# EAGLE design open-race-scale-pi-zero-board-v.02 (EAGLE 8.2.2)
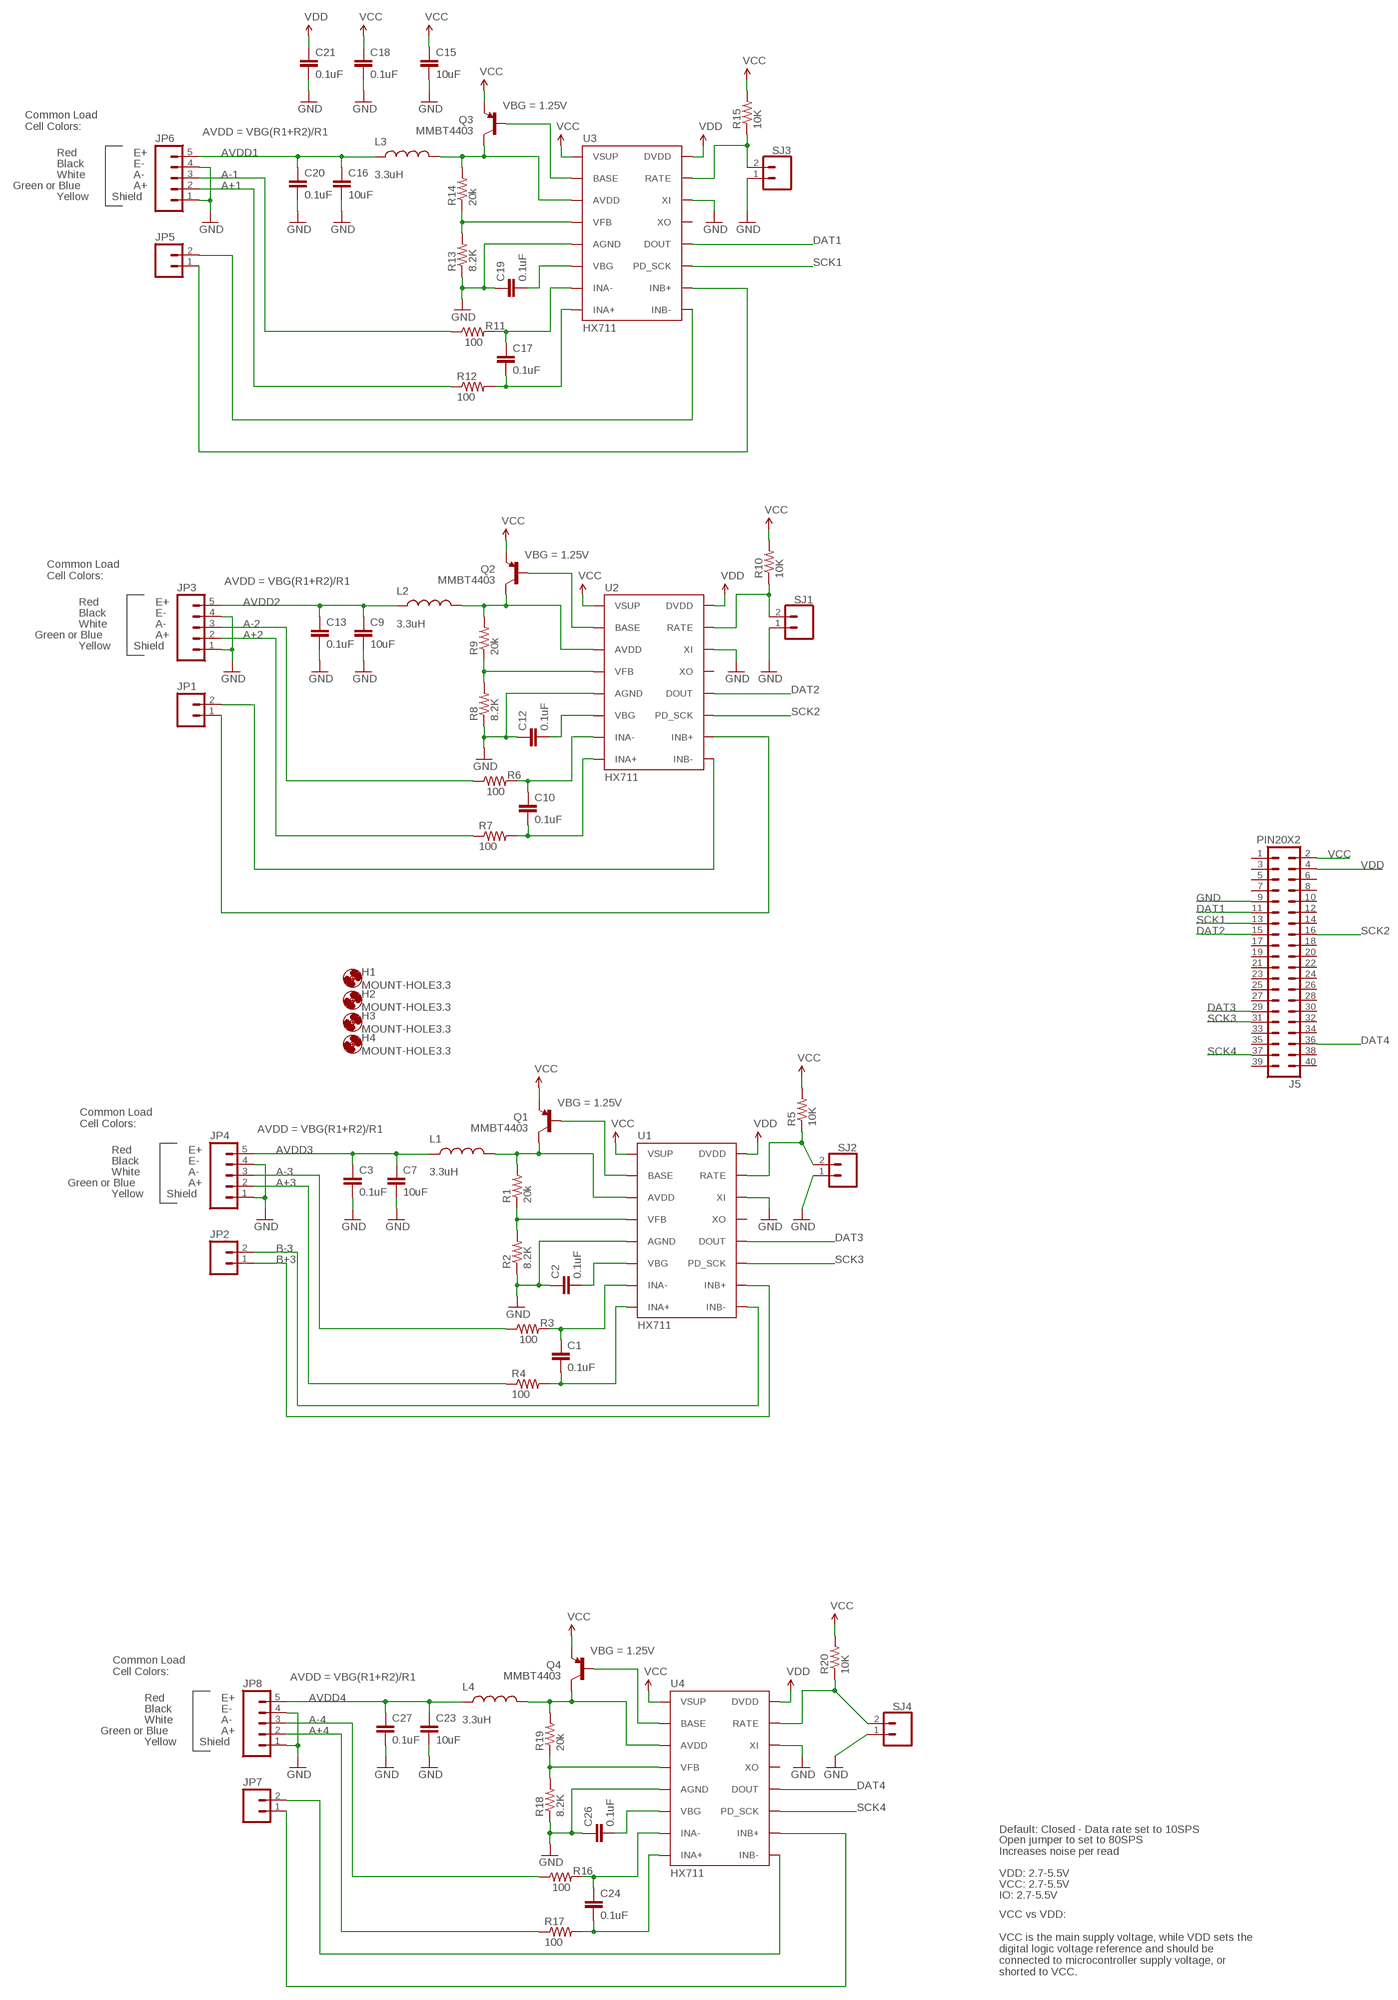
[diagram p0: schematic, sheet 1]

## Parts
C1  0.1uF  0.1UF-25V-5%(0603)  [0603-CAP]
C2  0.1uF  0.1UF-25V-5%(0603)  [0603-CAP]
C3  0.1uF  0.1UF-25V-5%(0603)  [0603-CAP]
C7  10uF  10UF50V20%(1210)  [1210]
C9  10uF  10UF50V20%(1210)  [1210]
C10  0.1uF  0.1UF-25V-5%(0603)  [0603-CAP]
C12  0.1uF  0.1UF-25V-5%(0603)  [0603-CAP]
C13  0.1uF  0.1UF-25V-5%(0603)  [0603-CAP]
C15  10uF  10UF50V20%(1210)  [1210]
C16  10uF  10UF50V20%(1210)  [1210]
C17  0.1uF  0.1UF-25V-5%(0603)  [0603-CAP]
C18  0.1uF  0.1UF-25V-5%(0603)  [0603-CAP]
C19  0.1uF  0.1UF-25V-5%(0603)  [0603-CAP]
C20  0.1uF  0.1UF-25V-5%(0603)  [0603-CAP]
C21  0.1uF  0.1UF-25V-5%(0603)  [0603-CAP]
C23  10uF  10UF50V20%(1210)  [1210]
C24  0.1uF  0.1UF-25V-5%(0603)  [0603-CAP]
C26  0.1uF  0.1UF-25V-5%(0603)  [0603-CAP]
C27  0.1uF  0.1UF-25V-5%(0603)  [0603-CAP]
H1  MOUNT-HOLE3.3  [3,3]
H2  MOUNT-HOLE3.3  [3,3]
H3  MOUNT-HOLE3.3  [3,3]
H4  MOUNT-HOLE3.3  [3,3]
J5  PIN20X2  [PIN_20X2]
JP1  M02PTH  [1X02@1]
JP2  M02PTH  [1X02@1]
JP3  M05PTH  [1X05]
JP4  M05PTH  [1X05]
JP5  M02PTH  [1X02@1]
JP6  M05PTH  [1X05]
JP7  M02PTH  [1X02@1]
JP8  M05PTH  [1X05]
L1  3.3uH  INDUCTOR0805-IND  [0805]
L2  3.3uH  INDUCTOR0805-IND  [0805]
L3  3.3uH  INDUCTOR0805-IND  [0805]
L4  3.3uH  INDUCTOR0805-IND  [0805]
Q1  MMBT4403  TRANSISTOR_PNPMMBT4403  [SOT23-3]
Q2  MMBT4403  TRANSISTOR_PNPMMBT4403  [SOT23-3]
Q3  MMBT4403  TRANSISTOR_PNPMMBT4403  [SOT23-3]
Q4  MMBT4403  TRANSISTOR_PNPMMBT4403  [SOT23-3]
R1  20k  20KOHM1/10W1%(0603)  [0603-RES]
R2  8.2K  8.2KOHM-1/10W-5%(0603)  [0603-RES]
R3  100  100OHM-1/10W-1%(0603)  [0603-RES]
R4  100  100OHM-1/10W-1%(0603)  [0603-RES]
R5  10K  10KOHM-1/10W-1%(0603)0603  [0603-RES]
R6  100  100OHM-1/10W-1%(0603)  [0603-RES]
R7  100  100OHM-1/10W-1%(0603)  [0603-RES]
R8  8.2K  8.2KOHM-1/10W-5%(0603)  [0603-RES]
R9  20k  20KOHM1/10W1%(0603)  [0603-RES]
R10  10K  10KOHM-1/10W-1%(0603)0603  [0603-RES]
R11  100  100OHM-1/10W-1%(0603)  [0603-RES]
R12  100  100OHM-1/10W-1%(0603)  [0603-RES]
R13  8.2K  8.2KOHM-1/10W-5%(0603)  [0603-RES]
R14  20k  20KOHM1/10W1%(0603)  [0603-RES]
R15  10K  10KOHM-1/10W-1%(0603)0603  [0603-RES]
R16  100  100OHM-1/10W-1%(0603)  [0603-RES]
R17  100  100OHM-1/10W-1%(0603)  [0603-RES]
R18  8.2K  8.2KOHM-1/10W-5%(0603)  [0603-RES]
R19  20k  20KOHM1/10W1%(0603)  [0603-RES]
R20  10K  10KOHM-1/10W-1%(0603)0603  [0603-RES]
SJ1  CONN_02  [1X02]
SJ2  CONN_02  [1X02]
SJ3  CONN_02  [1X02]
SJ4  CONN_02  [1X02]
U1  HX711  HX711HX711  [SO16]
U2  HX711  HX711HX711  [SO16]
U3  HX711  HX711HX711  [SO16]
U4  HX711  HX711HX711  [SO16]

## Nets
A+1: JP6.2 R12.1
A+2: JP3.2 R7.1
A+3: JP4.2 R4.1
A+4: JP8.2 R17.1
A-1: JP6.3 R11.1
A-2: JP3.3 R6.1
A-3: JP4.3 R3.1
A-4: JP8.3 R16.1
AVDD1: C16.1 C20.1 JP6.5 L3.1
AVDD2: C9.1 C13.1 JP3.5 L2.1
AVDD3: C3.1 C7.1 JP4.5 L1.1
AVDD4: C23.1 C27.1 JP8.5 L4.1
B+3: JP2.1 U1.10(INB+)
B-3: JP2.2 U1.9(INB-)
DAT1: J5.11 U3.12(DOUT)
DAT2: J5.15 U2.12(DOUT)
DAT3: J5.29 U1.12(DOUT)
DAT4: J5.36 U4.12(DOUT)
GND: C2.1 C3.2 C7.2 C9.2 C12.1 C13.2 C15.2 C16.2 C18.2 C19.1 C20.2 C21.2 C23.2 C26.1 C27.2 J5.9 JP3.1 JP3.4 JP4.1 JP4.4 JP6.1 JP6.4 JP8.1 JP8.4 R2.1 R8.1 R13.1 R18.1 SJ1.1 SJ2.1 SJ3.1 SJ4.1 U1.5(AGND) U1.14(XI) U2.5(AGND) U2.14(XI) U3.5(AGND) U3.14(XI) U4.5(AGND) U4.14(XI)
N$1: R5.1 SJ2.2 U1.15(RATE)
N$2: C1.1 R3.2 U1.7(INA-)
N$3: C1.2 R4.2 U1.8(INA+)
N$4: Q1.1(B) U1.2(BASE)
N$5: L1.2 Q1.3(C) R1.2 U1.3(AVDD)
N$6: R1.1 R2.2 U1.4(VFB)
N$7: C2.2 U1.6(VBG)
N$8: JP7.1 U4.10(INB+)
N$9: R8.2 R9.1 U2.4(VFB)
N$10: C12.2 U2.6(VBG)
N$11: JP5.1 U3.10(INB+)
N$12: JP5.2 U3.9(INB-)
N$13: JP7.2 U4.9(INB-)
N$14: JP1.1 U2.10(INB+)
N$15: JP1.2 U2.9(INB-)
N$20: C17.1 R11.2 U3.7(INA-)
N$21: C17.2 R12.2 U3.8(INA+)
N$22: Q4.1(B) U4.2(BASE)
N$23: R18.2 R19.1 U4.4(VFB)
N$24: C26.2 U4.6(VBG)
N$25: L4.2 Q4.3(C) R19.2 U4.3(AVDD)
N$26: R20.1 SJ4.2 U4.15(RATE)
N$27: C24.1 R16.2 U4.7(INA-)
N$28: C24.2 R17.2 U4.8(INA+)
N$82: Q2.1(B) U2.2(BASE)
N$112: L2.2 Q2.3(C) R9.2 U2.3(AVDD)
N$122: R10.1 SJ1.2 U2.15(RATE)
N$132: C10.1 R6.2 U2.7(INA-)
N$142: C10.2 R7.2 U2.8(INA+)
N$151: Q3.1(B) U3.2(BASE)
N$161: R13.2 R14.1 U3.4(VFB)
N$171: C19.2 U3.6(VBG)
N$182: L3.2 Q3.3(C) R14.2 U3.3(AVDD)
N$191: R15.1 SJ3.2 U3.15(RATE)
SCK1: J5.13 U3.11(PD_SCK)
SCK2: J5.16 U2.11(PD_SCK)
SCK3: J5.31 U1.11(PD_SCK)
SCK4: J5.37 U4.11(PD_SCK)
VCC: C15.1 C18.1 J5.2 Q1.2(E) Q2.2(E) Q3.2(E) Q4.2(E) R5.2 R10.2 R15.2 R20.2 U1.1(VSUP) U2.1(VSUP) U3.1(VSUP) U4.1(VSUP)
VDD: C21.1 J5.4 U1.16(DVDD) U2.16(DVDD) U3.16(DVDD) U4.16(DVDD)
Unconnected: J5.1 J5.3 J5.5 J5.6 J5.7 J5.8 J5.10 J5.12 J5.14 J5.17 J5.18 J5.19 J5.20 J5.21 J5.22 J5.23 J5.24 J5.25 J5.26 J5.27 J5.28 J5.30 J5.32 J5.33 J5.34 J5.35 J5.38 J5.39 J5.40 U1.13(XO) U2.13(XO) U3.13(XO) U4.13(XO)

## Notes on the sheet
- VBG = 1.25V
- Common Load
  Cell Colors:
- AVDD = VBG(R1+R2)/R1
- Red | E+
- Black | E-
- White | A-
- Green or Blue | A+
- Yellow | Shield
- VBG = 1.25V
- Common Load
  Cell Colors:
- AVDD = VBG(R1+R2)/R1
- Red | E+
- Black | E-
- White | A-
- Green or Blue | A+
- Yellow | Shield
- VBG = 1.25V
- Common Load
  Cell Colors:
- AVDD = VBG(R1+R2)/R1
- Red | E+
- Black | E-
- White | A-
- Green or Blue | A+
- Yellow | Shield
- VBG = 1.25V
- Common Load
  Cell Colors:
- AVDD = VBG(R1+R2)/R1
- Red | E+
- Black | E-
- White | A-
- Green or Blue | A+
- Yellow | Shield
- Default: Closed - Data rate set to 10SPS
- Open jumper to set to 80SPS
  Increases noise per read
- VDD: 2.7-5.5V
- VCC: 2.7-5.5V
- IO: 2.7-5.5V
- VCC vs VDD:
  
  VCC is the main supply voltage, while VDD sets the
  digital logic voltage reference and should be
  connected to microcontroller supply voltage, or
  shorted to VCC.

## Library data of the parts
C1-C3 C10 C12 C13 C17-C21 C24 C26 C27 = SparkFun-Capacitors:0.1UF-25V-5%(0603): CAP-08604; PROD_ID: CAP-08604
C7 C9 C15 C16 C23 = SparkFun-Capacitors:10UF50V20%(1210): CAP-09824; PROD_ID: CAP-09824
H1-H4 = holes:MOUNT-HOLE: MOUNTING HOLE with drill center marker
J5 = FLYFISH:PIN20X2
JP1 JP2 JP5 JP7 = SparkFun-Connectors:M02: Standard 2-pin 0.1" header. Use with - straight break away headers ( PRT-00116) - right angle break away headers (PRT-00553) - swiss pins (PRT-00743) - machine pins (PRT-00117) - female headers (PRT-00115) Molex polarized connector foot print use with: PRT-08233 with associated crimp pins and housings. 2.54_SCREWTERM for use with PRT-10571. 3.5mm Screw Terminal footprints for PRT-08084 5mm Screw Terminal footprints for use with PRT-08432
JP3 JP4 JP6 JP8 = SparkFun-Connectors:M05: Header 5 Standard 5-pin 0.1" header. Use with straight break away headers (SKU : PRT-00116), right angle break away headers (PRT-00553), swiss pins (PRT-00743), machine pins (PRT-00117), and female headers (PRT-00115). Molex polarized connector foot print use with SKU : PRT-08230 with associated crimp pins and housings.
L1-L4 = SparkFun-Passives:INDUCTOR: Inductors Basic Inductor/Choke - 0603 and 1206. Footprints are not proven and vary greatly between part numbers. INDUCTOR POWER 3.3UH 4.0A SMD 0.197" L x 0.197" W x 0.177" H (5.00mm x 5.00mm x 4.50mm); PROD_ID: NDUC-13076
Q1-Q4 = SparkFun-DiscreteSemi:TRANSISTOR_PNP: Generic PNP BJT Double check pinouts against datasheets- not all devices are the same! MMBT3906 - 40V 200mA SOT-23 (TRANS-08052) MMBT4403 - 40V 600mA SOT-23 (TRANS-09245); PROD_ID: TRANS-09245
R1 R9 R14 R19 = SparkFun-Resistors:20KOHM1/10W1%(0603): RES-09383; PROD_ID: RES-09383
R2 R8 R13 R18 = SparkFun-Resistors:8.2KOHM-1/10W-5%(0603): RES-10646; PROD_ID: RES-10646
R3 R4 R6 R7 R11 R12 R16 R17 = SparkFun-Resistors:100OHM-1/10W-1%(0603): RES-07863; PROD_ID: RES-07863
R5 R10 R15 R20 = SparkFun-Resistors:10KOHM-1/10W-1%(0603): RES-00824; PROD_ID: RES-00824
SJ1-SJ4 = SparkFun-Connectors:CONN_02: Multi connection point. Often used as Generic Header-pin footprint for 0.1 inch spaced/style header connections On any of the 0.1 inch spaced packages, you can populate with these: Break Away Headers - Straight <https://www.sparkfun.com/products/116> (PRT-00116) Break Away Male Headers - Right Angle <https://www.sparkfun.com/products/553> (PRT-00553) Female Headers <https://www.sparkfun.com/products/115> (PRT-00115) Break Away Headers - Machine Pin <https://www.sparkfun.com/products/117> (PRT-00117) Break Away Female Headers - Swiss Machine Pin <https://www.sparkfun.com/products/743> (PRT-00743) For SCREWTERMINALS and SPRING TERMINALS visit here: Screw Terimnals on SparkFun.com <https://www.sparkfun.com/search/results?term=Screw+Terminals> (5mm/3.5mm/2.54mm spacing) This device is also useful as a general connection point to wire up your design to another part of your project. Our various solder wires solder well into these plated through hole pads. Hook-Up Wire - Assortment (Stranded, 22 AWG) <https://www.sparkfun.com/products/11375> (PRT-11375) Hook-Up Wire - Assortment (Solid Core, 22 AWG) <https://www.sparkfun.com/products/11367> (PRT-11367) View the entire wire category on our website here <https://www.sparkfun.com/categories/141> Special notes: Molex polarized connector foot print use with: PRT-08233 with associated crimp pins and housings. 2.54_SCREWTERM for use with PRT-10571. 3.5mm Screw Terminal footprints for PRT-08084 5mm Screw Terminal footprints for use with PRT-08432
U1-U4 = Testing:HX711; PROD_ID: IC-12445

## Board
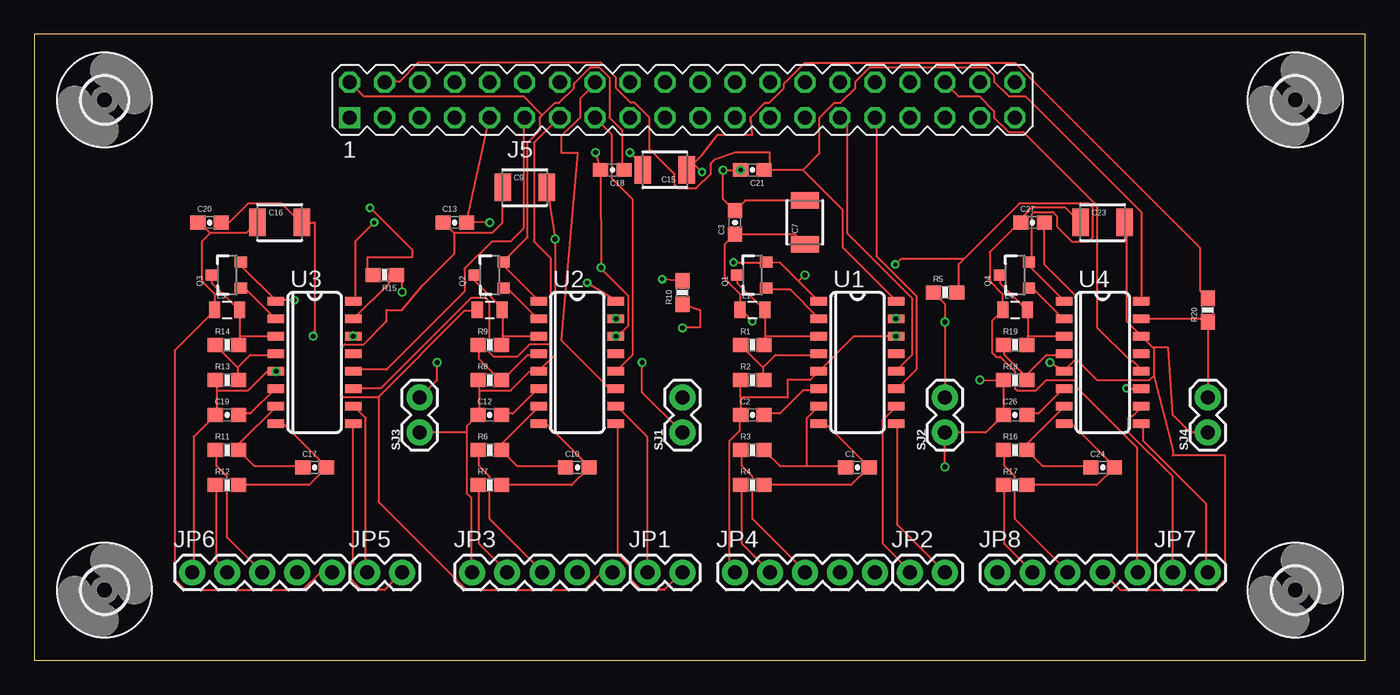
[diagram p1: board, top side]
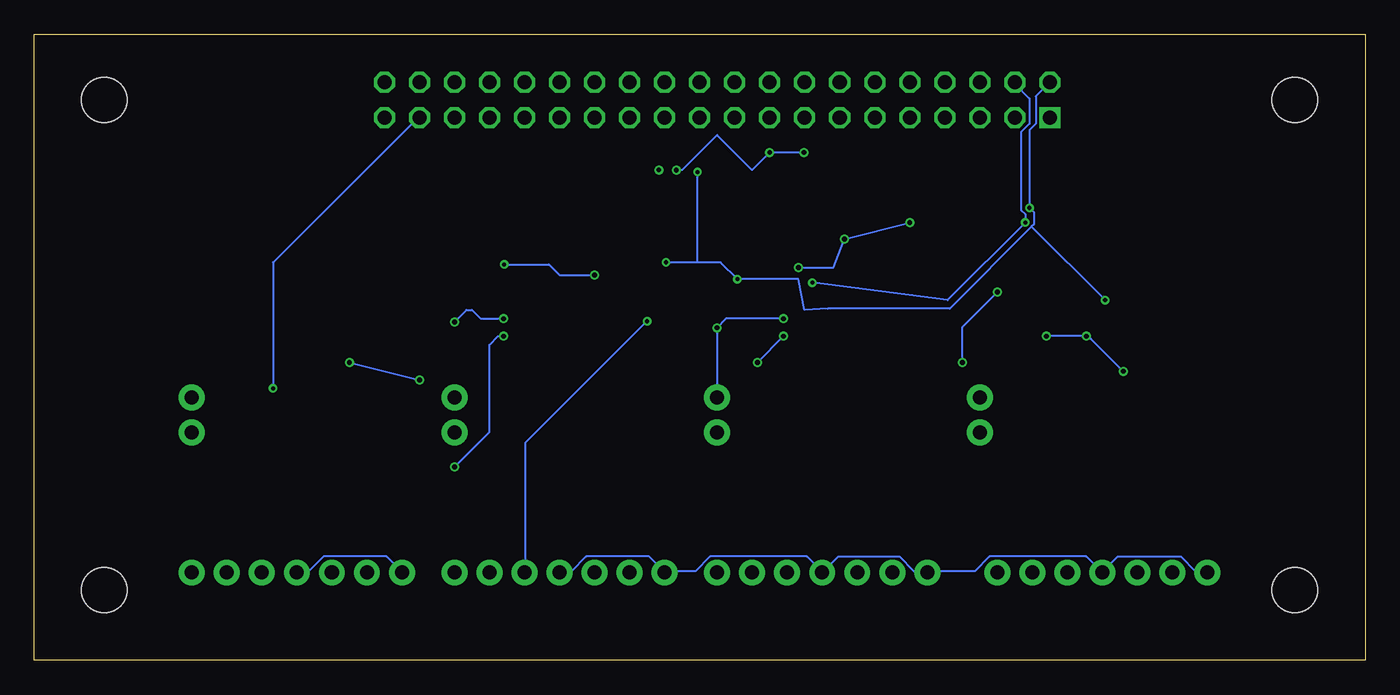
[diagram p2: board, bottom side, seen from below]

Size 96.5 x 45.39 mm. Coordinates in mm from the lower left corner, seen from the top.
Outline: 0,0 96.5,0 96.5,45.39 0,45.39 0,0
Copper layers (1*16): Top 0.035mm / dielectric 1.5mm / Bottom 0.035mm
Design rules "SeeedStudio_2layer_DRU_no_angle_20140221": minimum track width 6mil, minimum drill 12mil, track to track 6mil, track to pad 6mil, pad to pad 6mil, via to via 6mil, smd to smd 0mil, copper to edge 10mil, drill to drill 10mil, minimum pad ring 10mil, minimum via ring 6mil, stop-mask expansion 2mil, vias tented up to drill 100mil, thermal gap 10mil

### Footprints (pad centres in the part's own frame; a part is rotated, then mirrored left to right if it is on the bottom)
0603-CAP = smd 1.1 x 1: 1 -0.85,0; 2 0.85,0
1210 = smd 1.2 x 2: 1 -1.6,0; 2 1.6,0
3,3 = hole 3.3: 0,0
PIN_20X2 = drill 1.016 square: 1 -24.13,-1.27 | drill 1.016 octagon: 2 -24.13,1.27; 3 -21.59,-1.27; 4 -21.59,1.27; 5 -19.05,-1.27; 6 -19.05,1.27; 7 -16.51,-1.27; 8 -16.51,1.27; 9 -13.97,-1.27; 10 -13.97,1.27; 11 -11.43,-1.27; 12 -11.43,1.27; 13 -8.89,-1.27; 14 -8.89,1.27; 15 -6.35,-1.27; 16 -6.35,1.27; 17 -3.81,-1.27; 18 -3.81,1.27; 19 -1.27,-1.27; 20 -1.27,1.27; 21 1.27,-1.27; 22 1.27,1.27; 23 3.81,-1.27; 24 3.81,1.27; 25 6.35,-1.27; 26 6.35,1.27; 27 8.89,-1.27; 28 8.89,1.27; 29 11.43,-1.27; 30 11.43,1.27; 31 13.97,-1.27; 32 13.97,1.27; 33 16.51,-1.27; 34 16.51,1.27; 35 19.05,-1.27; 36 19.05,1.27; 37 21.59,-1.27; 38 21.59,1.27; 39 24.13,-1.27; 40 24.13,1.27
1X02@1 = drill 1.016 pad 1.88: 1 0,0; 2 2.54,0
1X05 = drill 1.016 pad 1.88: 1 0,0; 2 2.54,0; 3 5.08,0; 4 7.62,0; 5 10.16,0
0805 = smd 0.8 x 1.2: 1 -0.9,0; 2 0.9,0
SOT23-3 = smd 0.8 x 0.9: 1 -0.95,-1; 2 0.95,-1; 3 0,1.1
0603-RES = smd 1.1 x 1: 1 -0.85,0; 2 0.85,0
1X02 = drill 1.016 pad 1.88: 1 0,0; 2 2.54,0
SO16 = smd 0.6 x 1.2: 1 -4.445,-2.8; 2 -3.175,-2.8; 3 -1.905,-2.8; 4 -0.635,-2.8; 5 0.635,-2.8; 6 1.905,-2.8; 7 3.175,-2.8; 8 4.445,-2.8; 9 4.445,2.8; 10 3.175,2.8; 11 1.905,2.8; 12 0.635,2.8; 13 -0.635,2.8; 14 -1.905,2.8; 15 -3.175,2.8; 16 -4.445,2.8

### Placement (x,y rotation side)
C1  59.69,13.97 0 top
C2  52.07,17.78 0 top
C3  50.8,31.75 90 top
C7  55.88,31.75 90 top
C9  35.56,34.29 0 top
C10  39.37,13.97 0 top
C12  33.02,17.78 0 top
C13  30.48,31.75 0 top
C15  45.72,35.56 180 top
C16  17.78,31.75 0 top
C17  20.32,13.97 0 top
C18  41.91,35.56 180 top
C19  13.97,17.78 0 top
C20  12.7,31.75 0 top
C21  52.07,35.56 180 top
C23  77.47,31.75 0 top
C24  77.47,13.97 0 top
C26  71.12,17.78 0 top
C27  72.39,31.75 0 top
H1  5.08,5.08 0 top
H2  5.08,40.64 0 top
H3  91.44,40.64 0 top
H4  91.44,5.08 0 top
J5  46.99,40.64 0 top
JP1  44.45,6.35 0 top
JP2  63.5,6.35 0 top
JP3  31.75,6.35 0 top
JP4  50.8,6.35 0 top
JP5  24.13,6.35 0 top
JP6  11.43,6.35 0 top
JP7  82.55,6.35 0 top
JP8  69.85,6.35 0 top
L1  52.07,25.4 0 top
L2  33.02,25.4 0 top
L3  13.97,25.4 0 top
L4  71.12,25.4 0 top
Q1  52.07,27.94 90 top
Q2  33.02,27.94 90 top
Q3  13.97,27.94 90 top
Q4  71.12,27.94 90 top
R1  52.07,22.86 0 top
R2  52.07,20.32 0 top
R3  52.07,15.24 0 top
R4  52.07,12.7 0 top
R5  66.04,26.67 0 top
R6  33.02,15.24 0 top
R7  33.02,12.7 0 top
R8  33.02,20.32 0 top
R9  33.02,22.86 0 top
R10  46.99,26.67 90 top
R11  13.97,15.24 0 top
R12  13.97,12.7 0 top
R13  13.97,20.32 0 top
R14  13.97,22.86 0 top
R15  25.4,27.94 180 top
R16  71.12,15.24 0 top
R17  71.12,12.7 0 top
R18  71.12,20.32 0 top
R19  71.12,22.86 0 top
R20  85.09,25.4 90 top
SJ1  46.99,16.51 90 top
SJ2  66.04,16.51 90 top
SJ3  27.94,16.51 90 top
SJ4  85.09,16.51 90 top
U1  59.69,21.59 270 top
U2  39.37,21.59 270 top
U3  20.32,21.59 270 top
U4  77.47,21.59 270 top

### Tracks (layer width: path | path; a pad name or v marks a point on that pad's centre or on a via)
A+1
  Top 0.152: R12.1 13.21,12.7 13.21,7.21 13.97,6.45 JP6.2
A+2
  Top 0.152: R7.1 32.26,12.7 32.26,8.43 34.24,6.45 JP3.2
A+3
  Top 0.152: R4.1 51.31,12.7 51.31,8.43 53.29,6.45 JP4.2
A+4
  Top 0.152: R17.1 70.36,12.7 70.36,8.43 72.34,6.45 JP8.2
A-1
  Top 0.152: JP6.3 13.97,8.89 13.97,13.31 13.21,14.07 13.21,15.14 R11.1
A-2
  Top 0.152: R6.1 32.26,15.14 32.26,14.07 33.02,13.31 33.02,10.26 36.83,6.45 JP3.3
A-3
  Top 0.152: R3.1 51.31,15.14 51.31,14.07 52.07,13.31 52.07,10.26 55.88,6.45 JP4.3
A-4
  Top 0.152: R16.1 70.36,15.14 70.36,14.07 71.12,13.31 71.12,10.26 74.93,6.45 JP8.3
AVDD1
  Top 0.152: 12.75,30.99 11.99,31.75 C20.1 | 12.75,30.99 15.34,30.99 16.1,31.75 C16.1 | 12.75,30.99 12.14,30.38 12.14,27.48 13.06,26.57 13.06,25.5 L3.1 13.06,25.35 10.16,22.45 10.16,5.84 10.92,5.08 19.46,5.08 20.68,6.3 21.59,6.3 JP6.5
AVDD2
  Top 0.152: 30.43,30.99 29.67,31.75 C13.1 | 30.43,30.99 33.17,30.99 33.93,31.75 C9.1 | 24.94,19.1 31.19,25.35 32.11,25.35 L2.1 | 24.94,19.1 22.35,19.1 22.2,19.25 22.2,22.61 22.5,22.91 23.88,22.91 25.55,24.59 25.55,25.4 26.67,25.4 28.14,27.18 30.43,29.46 30.43,30.99 | 24.94,19.1 24.94,11.48 31.34,5.08 39.88,5.08 41.1,6.3 41.86,6.3 JP3.5
AVDD3  (via drill 0.3)
  Top 0.152: v52.07,24.59 51.31,25.35 L1.1 51.16,25.5 51.16,26.57 50.09,27.64 50.09,30.19 C3.1 55.13,30.9 C7.1
  Bottom 0.152: v52.07,24.59 60.91,15.75 60.91,6.45 JP4.5
AVDD4
  Top 0.152: C23.1 75.84,31.75 74.78,32.82 72.34,32.82 71.58,32.05 71.58,31.75 C27.1 71.42,31.75 69.29,29.62 69.29,27.48 70.21,26.57 70.21,25.5 L4.1 70.21,25.35 69.44,24.59 69.44,22.3 69.75,22 70.05,22 71.12,20.93 71.12,19.71 71.27,19.56 72.64,19.56 73.41,20.32 75.39,20.32 75.54,20.17 75.54,19.86 79.96,15.44 79.96,6.45 JP8.5
B+3
  Top 0.152: U1.10 62.43,18.34 61.52,17.42 61.52,8.43 63.5,6.45 JP2.1
B-3
  Top 0.152: JP2.2 62.59,9.8 62.59,17.12 U1.9
DAT1
  Top 0.152: U3.12 23.27,21.08 25.55,21.08 31.19,26.72 31.19,28.4 33.17,30.38 34.54,30.38 35.46,31.29 35.46,39.37 J5.11
DAT2
  Top 0.152: J5.15 41.86,38.15 41.86,34.95 43.38,33.43 43.38,22.15 42.32,21.08 U2.12
DAT3
  Top 0.152: U1.12 62.59,21.08 63.65,22.15 63.65,26.26 58.93,30.99 58.93,38.91 58.47,39.37 J5.29
DAT4
  Top 0.152: U4.12 80.26,21.08 79.65,21.69 79.5,21.69 77.06,24.13 77.06,32.97 71.73,38.3 70.66,38.3 69.6,39.37 69.6,39.83 68.53,40.89 67,40.89 66.09,41.81 J5.36
GND  (via drill 0.35)
  Top 0.152: C23.2 79.2,31.75 79.2,24.59 80.26,23.52 U4.14 80.42,23.37 81.1,22.68 | 75.54,21.84 75.54,26.42 73.25,28.7 73.25,31.75 C27.2 | 81.1,22.68 81.18,22.61 81.18,20.62 | 81.18,20.62 80.87,20.32 77.06,20.32 75.54,21.84 | 70.36,17.88 C26.1 | JP8.4 78.74,5.08 85.6,5.08 86.36,5.84 86.36,14.83 82.55,14.83 82.55,15.24 81.18,20.62 | JP4.1 50.39,6.76 50.39,15.9 51.16,16.66 51.16,17.73 C2.1 51.22,19.07 | 32.26,19.56 32.26,20.32 R8.1 | 32.26,19.56 32.26,17.88 C12.1 32.11,17.73 31.34,16.97 31.34,16.51 | 32.26,19.56 34.54,19.56 35.92,20.93 36.52,20.93 U2.5 36.68,21.08 37.74,22.15 v37.74,30.55 37.74,30.58 | 31.34,16.51 31.34,12.09 31.65,11.79 31.65,6.45 JP3.1 | 69.75,6.45 JP8.1 | 41.1,35.56 C18.2 | C20.2 14.12,31.75 15.49,33.12 17.93,33.12 19.3,31.75 C16.2 20.32,31.75 20.32,23.5 v20.2,23.5 | 13.21,19.56 13.21,20.32 R13.1 | 13.21,19.56 13.21,17.88 C19.1 13.06,17.73 11.53,16.2 11.53,6.45 JP6.1 | 13.21,19.56 15.49,19.56 16.87,20.93 17.48,20.93 U3.5 | 81.1,22.68 82.22,22.68 82.55,17.78 83.82,16.51 SJ4.1 | v42.17,23.5 42.29,23.5 43.08,24.28 43.08,26.42 41.1,28.4 v41.1,28.47 C18.2 | 37.74,30.58 | C7.2 51.55,33.35 C3.2 49.95,33.45 v49.95,35.56 C21.2 | 51.22,19.07 R2.1 | C15.2 44.12,35.89 v43.18,36.83 | v40.68,36.83 C18.2 | C26.1 69,16.51 SJ2.1 v66.04,14.02 66.04,13.97 | 51.22,19.07 54.59,19.07 54.61,19.05 54.61,20.32 56.26,20.32 U1.5 59.43,23.5 v62.49,23.5 | SJ1.1 44.08,19.42 v44.08,21.59 | 31.34,16.51 SJ3.1 | 75.54,21.84 74.78,21.08 U4.5 v73.66,21.59 | 70.27,20.28 C26.1 | 70.27,20.28 R18.1 | v68.58,20.32 70.27,20.28 | 31.34,31.78 J5.9 | 31.34,31.78 C13.2 | C9.2 37.74,30.58 | v33.02,31.75 31.34,31.78
  Bottom 0.152: JP8.4 77.37,6.45 76.61,6.45 75.54,7.52 70.97,7.52 69.9,6.45 JP8.1 | JP4.4 58.32,6.45 57.56,6.45 56.49,7.52 51.92,7.52 50.85,6.45 JP4.1 50.7,6.45 48.57,6.45 47.5,7.52 40.49,7.52 39.42,6.45 JP3.4 38.2,7.52 33.78,7.52 32.71,6.45 31.8,6.45 JP3.1 31.65,6.45 28.3,6.45 27.23,7.52 20.22,7.52 JP6.4 19,6.45 17.93,7.52 13.36,7.52 12.29,6.45 11.53,6.45 JP6.1 | 62.62,23.62 v62.49,23.5 62.87,23.5 63.5,22.86 63.5,16.56 v66.04,14.02 | v41.1,28.47 38.56,28.47 37.82,30.37 v37.74,30.55 v33.02,31.75 | v44.08,21.59 v42.17,23.5 | 40.64,36.83 v40.68,36.83 v43.18,36.83 44.45,35.56 46.99,38.1 49.53,35.56 v49.95,35.56 | v73.66,21.59 v68.58,20.32 | v23.12,23.5 v20.2,23.5 20.02,23.31 19.87,23.31 U3.5
  other vias: 51.22,35.56 17.52,20.95
N$1  (via drill 0.35)
  Top 0.152: SJ2.2 v66.04,24.53 66.04,25.82 R5.1 | U1.15 62.5,24.75
  Bottom 0.152: v66.04,24.53 65.17,25.4 64.77,25.4 64.13,24.77 U1.15
  other vias: 62.49,24.77
N$2
  Top 0.152: 56.03,14.07 54.05,14.07 52.98,15.14 R3.2 | 56.03,14.07 58.78,14.07 C1.1 | 56.03,14.07 56.03,17.58 56.79,18.34 U1.7
N$3
  Top 0.152: R4.2 59.23,12.7 60.45,13.92 C1.2 60.45,14.07 57.4,17.12 56.95,17.12 U1.8
N$4
  Top 0.152: Q1.1 53.14,26.87 54.81,26.87 56.79,24.89 U1.2
N$5
  Top 0.152: Q1.3 51,27.94 51,27.33 52.83,25.5 L1.2 52.98,25.35 52.98,23.52 | 52.98,23.52 52.98,22.91 R1.2 | 52.98,23.52 56.79,23.52 U1.3
N$6
  Top 0.152: 52.83,21.23 52.83,20.32 R2.2 | 52.83,21.23 51.31,22.76 R1.1 | 52.83,21.23 53.75,22.15 56.79,22.15 U1.4
N$7
  Top 0.152: C2.2 52.98,17.88 54.05,17.88 55.73,19.56 56.79,19.56 U1.6
N$8
  Top 0.152: JP7.1 82.55,13.31 79.35,16.51 79.35,17.58 79.5,17.73 79.65,17.73 80.26,18.34 U4.10
N$9
  Top 0.152: R9.1 32.26,22.76 32.26,21.84 33.78,20.32 R8.2 33.93,20.32 35.76,22.15 36.52,22.15 U2.4
N$10
  Top 0.152: C12.2 33.93,17.88 34.7,17.88 36.52,19.71 U2.6
N$11
  Top 0.152: U3.10 23.27,18.34 24.03,17.58 24.03,6.45 JP5.1
N$12
  Top 0.152: JP5.2 25.4,5.08 23.72,5.08 22.96,5.84 22.96,6.91 23.11,7.06 23.11,17.12 U3.9
N$13
  Top 0.152: U4.9 80.42,17.12 80.42,15.9 84.99,11.33 84.99,6.45 JP7.2
N$14
  Top 0.152: JP1.1 44.45,16.2 42.32,18.34 U2.10
N$15
  Top 0.152: U2.9 42.32,17.12 42.32,7.67 43.23,6.76 43.23,5.84 43.99,5.08 45.67,5.08 46.89,6.3 JP1.2
N$20
  Top 0.152: C17.1 19.46,14.07 15.95,14.07 14.88,15.14 R11.2 14.88,15.29 14.88,15.75 17.48,18.34 U3.7
N$21
  Top 0.152: R12.2 19.91,12.7 21.13,13.92 C17.2 21.13,14.07 18.09,17.12 17.63,17.12 U3.8
N$22
  Top 0.152: Q4.1 72.19,26.87 72.49,26.87 74.62,24.74 U4.2
N$23
  Top 0.152: 71.88,20.62 70.36,22.15 70.36,22.76 R19.1 | 71.88,20.62 71.88,20.32 R18.2 71.88,20.62 | 71.88,20.62 73.41,22.15 74.62,22.15 U4.4
N$24
  Top 0.152: C26.2 72.03,17.88 72.8,17.88 74.62,19.71 U4.6
N$25
  Top 0.152: Q4.3 70.05,27.94 70.05,27.33 71.88,25.5 L4.2 72.03,25.35 72.03,23.52 | 72.03,23.52 72.03,22.91 R19.2 | 72.03,23.52 74.62,23.52 U4.3
N$26
  Top 0.152: 80.42,24.89 U4.15 84.88,24.77 R20.1 SJ4.2
N$27
  Top 0.152: C24.1 76.61,14.07 73.1,14.07 72.03,15.14 R16.2 72.03,15.29 72.03,15.75 74.62,18.34 U4.7
N$28
  Top 0.152: R17.2 77.06,12.7 78.28,13.92 C24.2 78.28,14.07 75.23,17.12 74.78,17.12 U4.8
N$82
  Top 0.152: Q2.1 34.09,26.87 34.39,26.87 36.52,24.74 U2.2
N$112
  Top 0.152: Q2.3 31.95,27.94 31.95,27.48 33.93,25.5 L2.2 33.93,25.35 33.93,23.52 | 33.93,23.52 33.93,22.91 R9.2 | 33.93,23.52 36.52,23.52 U2.3
N$122  (via drill 0.35)
  Top 0.152: R10.1 48.26,25.4 48.26,24.13 46.99,24.13 v46.99,24.11
  Bottom 0.152: U2.15 46.36,24.77 v46.99,24.11 SJ1.2
  other vias: 42.17,24.77
N$132
  Top 0.152: C10.1 38.51,14.07 35,14.07 33.93,15.14 R6.2 33.93,15.29 33.93,15.75 36.52,18.34 U2.7
N$142
  Top 0.152: R7.2 38.96,12.7 40.18,13.92 C10.2 40.18,14.07 37.13,17.12 36.68,17.12 U2.8
N$151
  Top 0.152: Q3.1 15.04,26.87 15.34,26.87 17.48,24.74 U3.2
N$161
  Top 0.152: 14.73,21.23 14.73,20.32 R13.2 | 14.73,21.23 13.21,22.76 R14.1 | 14.73,21.23 15.65,22.15 17.48,22.15 U3.4
N$171
  Top 0.152: C19.2 14.88,17.88 15.65,17.88 17.48,19.71 U3.6
N$182
  Top 0.152: Q3.3 12.9,27.94 12.9,27.33 14.73,25.5 L3.2 14.88,25.35 14.88,23.52 | 14.88,23.52 14.88,22.91 R14.2 | 14.88,23.52 17.48,23.52 U3.3
N$191  (via drill 0.35)
  Top 0.152: U3.15 23.27,24.89 25.7,27.33 25.7,27.94 R15.1 26.67,27.52 v26.67,26.7 26.67,26.67 | SJ3.2 29.21,20.32 v29.21,21.59
  Bottom 0.152: v26.67,26.7 29.21,24.16 v29.21,21.59
SCK1
  Top 0.152: U3.11 23.27,19.71 25.09,19.71 31.65,26.26 32.71,26.26 33.02,25.96 33.02,22.3 33.33,22 35,22 35.92,22.91 37.29,22.91 37.44,23.06 37.44,29.16 36.22,30.38 36.22,37.54 38.05,39.37 J5.13
SCK2
  Top 0.152: U2.11 42.16,19.71 41.71,19.71 38.2,23.22 39.37,36.83 38.2,36.83 38.2,38 39.57,39.37 39.57,40.74 40.64,41.81 J5.16
SCK3
  Top 0.152: U1.11 62.59,19.71 63.96,21.08 63.96,26.42 61.06,29.31 61.06,39.37 J5.31
SCK4  (via drill 0.3)
  Top 0.152: v79.2,19.71 80.26,19.71 U4.11
  Bottom 0.152: v79.2,19.71 79.2,28.85 68.68,39.37 J5.37
VCC  (via drill 0.3, 0.35)
  Top 0.152: 51.92,39.37 52.98,40.44 53.29,40.44 54.36,41.5 54.36,41.81 55.88,43.33 71.12,43.33 84.53,29.92 84.53,26.81 R20.2 | 51.92,39.06 51.92,39.37 | 47.8,36.02 47.35,35.56 C15.1 47.8,36.02 | 47.8,36.02 48.41,36.63 49.53,38.1 52.04,38.1 | U2.1 36.52,26.11 34.09,28.55 34.09,28.85 Q2.2 34.09,29.01 35.76,30.68 35.76,37.54 36.68,38.46 36.68,39.37 36.83,39.52 | 36.83,39.52 37.74,40.44 38.05,40.44 39.12,41.5 39.12,41.81 40.34,43.03 40.95,43.03 41.71,42.27 41.71,39.37 42.62,38.46 42.62,35.56 C18.1 | U4.1 74.62,26.11 72.19,28.55 72.19,28.85 Q4.2 72.19,29.01 72.34,29.16 72.34,32.36 72.49,32.51 73.86,32.51 74.17,32.21 74.17,31.44 75.23,30.38 76.45,30.38 76.76,30.68 76.76,32.82 76.45,33.12 71.42,33.12 67.41,29.11 | 67.41,29.11 67,28.7 67,26.78 R5.2 | 55.42,27.48 54.05,28.85 Q1.2 | 55.42,27.48 56.79,26.11 56.81,26.11 U1.1 | 53.14,28.85 Q1.2 | Q3.2 15.04,28.85 15.04,28.55 17.48,26.11 U3.1 17.63,26.11 v18.85,26.11 | v24.33,32.82 27.38,29.77 27.38,29.21 24.13,29.21 24.13,27.94 R15.2 | v50.7,28.85 52.98,28.85 Q1.2 | 36.83,39.52 35.46,40.89 23.88,40.89 J5.2 | v48.41,35.41 47.8,36.02 | v45.52,27.64 45.61,27.64 R10.2 | 67.41,29.11 62.84,29.11 v62.43,28.7 | 52.04,38.1 52.07,38.1 | 51.92,39.37 52.04,38.1 | 55.42,27.48 v55.88,27.94
  Bottom 0.152: J5.2 23.88,40.89 23.88,38.91 24.33,38.46 v24.33,32.82 24.03,32.51 24.03,31.6 24.18,31.44 | 24.18,31.44 30.12,25.5 38.96,25.5 40.64,25.4 41.1,27.64 v45.52,27.64 46.74,28.85 48.41,28.85 | 24.18,31.44 v18.85,26.11 | 48.41,28.85 v50.7,28.85 50.85,28.7 | 48.41,28.85 v48.41,35.41 | v62.43,28.7 59.18,28.7 58.42,27.94 v55.88,27.94
VDD  (via drill 0.3)
  Top 0.152: v24.64,31.75 23.27,30.38 23.27,26.11 U3.16 | U2.16 42.16,26.11 v40.08,27.38 | 55.73,35.56 C21.1 53.34,35.56 53.34,36.83 50.8,36.83 49.33,36.32 49.02,36.02 49.02,35.25 47.95,34.19 46.74,34.19 46.43,34.49 46.43,35.25 44.6,37.08 44.6,39.37 43.54,40.44 43.23,40.44 42.16,41.5 42.16,42.27 41.1,43.33 27.84,43.33 26.47,41.96 25.4,41.96 J5.4 | 55.73,35.56 58.62,32.66 58.62,29.92 62.43,26.11 U1.16 | 55.73,35.56 56.95,36.78 56.95,39.37 58.01,40.44 58.47,40.44 59.54,41.5 59.54,41.96 60.6,43.03 68.99,43.03 69.6,42.42 69.6,41.96 70.66,40.89 71.88,40.89 80.26,32.51 80.26,26.11 U4.16
  Bottom 0.152: J5.4 25.4,41.81 24.33,40.74 24.33,38.91 24.94,38.3 24.94,32.66 24.64,32.36 v24.64,31.75 30.28,26.11 v40.08,27.38